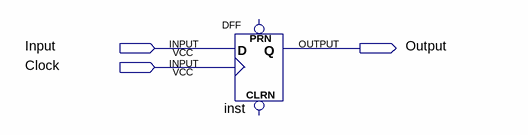
[diagram p0: schematic sheet]
// Quartus schematic Lab02_dd.bdf as structural Verilog: 1 symbols, 3 pins
module Lab02_dd (
  input  Input,
  input  Clock,
  output Output
);

  DFF inst (.CLK(Clock), .D(Input), .Q(Output));  // open: CLRN, PRN
endmodule
